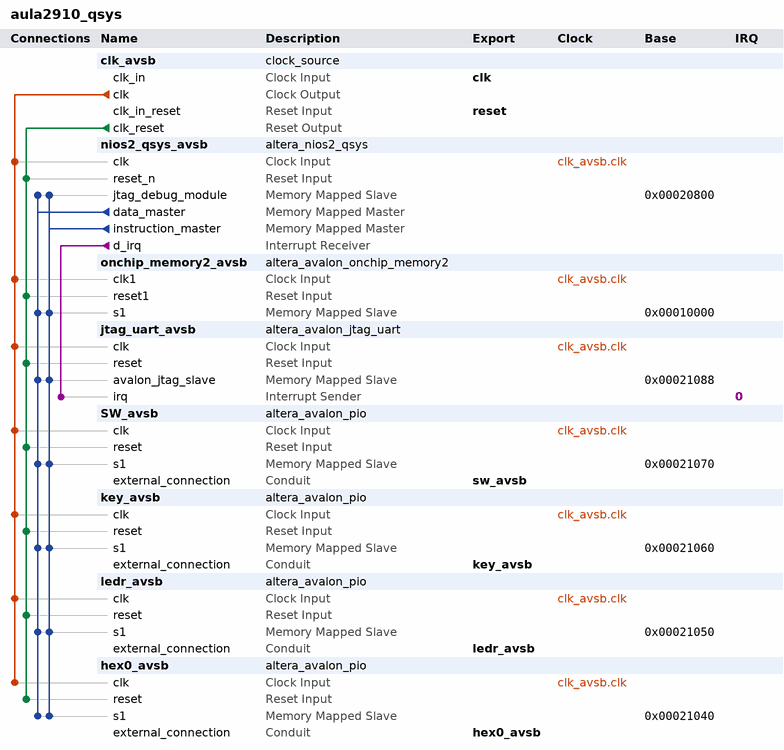
[diagram p0: system contents]
# Platform Designer (Qsys) system aula2910_qsys, Cyclone II EP2C35F672C6
# Parameters at their usual value, and those the tool derives, are not listed.
package require -exact qsys 13.0.1.99.2
create_system aula2910_qsys
set_project_property DEVICE_FAMILY {Cyclone II}
set_project_property DEVICE EP2C35F672C6

add_instance clk_avsb clock_source 13.0
set_instance_parameter_value clk_avsb clockFrequency 50000000

add_instance nios2_qsys_avsb altera_nios2_qsys 13.0
set_instance_parameter_value nios2_qsys_avsb resetSlave onchip_memory2_avsb.s1
set_instance_parameter_value nios2_qsys_avsb mmu_TLBMissExcSlave None
set_instance_parameter_value nios2_qsys_avsb exceptionSlave onchip_memory2_avsb.s1
set_instance_parameter_value nios2_qsys_avsb breakSlave nios2_qsys_avsb.jtag_debug_module
set_instance_parameter_value nios2_qsys_avsb impl Tiny
set_instance_parameter_value nios2_qsys_avsb icache_size 4096

add_instance onchip_memory2_avsb altera_avalon_onchip_memory2 13.0.1.99.2
set_instance_parameter_value onchip_memory2_avsb dataWidth 32
set_instance_parameter_value onchip_memory2_avsb dualPort false
set_instance_parameter_value onchip_memory2_avsb initMemContent true
set_instance_parameter_value onchip_memory2_avsb initializationFileName onchip_mem.hex
set_instance_parameter_value onchip_memory2_avsb memorySize 40960

add_instance jtag_uart_avsb altera_avalon_jtag_uart 13.0.1.99.2
set_instance_parameter_value jtag_uart_avsb simInteractiveOptions NO_INTERACTIVE_WINDOWS

add_instance SW_avsb altera_avalon_pio 13.0.1.99.2
set_instance_parameter_value SW_avsb direction Input
set_instance_parameter_value SW_avsb width 8

add_instance key_avsb altera_avalon_pio 13.0.1.99.2
set_instance_parameter_value key_avsb direction Input
set_instance_parameter_value key_avsb width 4

add_instance ledr_avsb altera_avalon_pio 13.0.1.99.2
set_instance_parameter_value ledr_avsb direction Output
set_instance_parameter_value ledr_avsb width 8

add_instance hex0_avsb altera_avalon_pio 13.0.1.99.2
set_instance_parameter_value hex0_avsb direction Output
set_instance_parameter_value hex0_avsb width 7

# connections
add_connection clk_avsb.clk hex0_avsb.clk clock
add_connection clk_avsb.clk jtag_uart_avsb.clk clock
add_connection clk_avsb.clk key_avsb.clk clock
add_connection clk_avsb.clk ledr_avsb.clk clock
add_connection clk_avsb.clk nios2_qsys_avsb.clk clock
add_connection clk_avsb.clk onchip_memory2_avsb.clk1 clock
add_connection clk_avsb.clk SW_avsb.clk clock
add_connection clk_avsb.clk_reset hex0_avsb.reset reset
add_connection clk_avsb.clk_reset jtag_uart_avsb.reset reset
add_connection clk_avsb.clk_reset key_avsb.reset reset
add_connection clk_avsb.clk_reset ledr_avsb.reset reset
add_connection clk_avsb.clk_reset nios2_qsys_avsb.reset_n reset
add_connection clk_avsb.clk_reset onchip_memory2_avsb.reset1 reset
add_connection clk_avsb.clk_reset SW_avsb.reset reset
add_connection nios2_qsys_avsb.data_master hex0_avsb.s1 avalon
set_connection_parameter_value nios2_qsys_avsb.data_master/hex0_avsb.s1 baseAddress 0x00021040
add_connection nios2_qsys_avsb.data_master jtag_uart_avsb.avalon_jtag_slave avalon
set_connection_parameter_value nios2_qsys_avsb.data_master/jtag_uart_avsb.avalon_jtag_slave baseAddress 0x00021088
add_connection nios2_qsys_avsb.data_master key_avsb.s1 avalon
set_connection_parameter_value nios2_qsys_avsb.data_master/key_avsb.s1 baseAddress 0x00021060
add_connection nios2_qsys_avsb.data_master ledr_avsb.s1 avalon
set_connection_parameter_value nios2_qsys_avsb.data_master/ledr_avsb.s1 baseAddress 0x00021050
add_connection nios2_qsys_avsb.data_master nios2_qsys_avsb.jtag_debug_module avalon
set_connection_parameter_value nios2_qsys_avsb.data_master/nios2_qsys_avsb.jtag_debug_module baseAddress 0x00020800
add_connection nios2_qsys_avsb.data_master onchip_memory2_avsb.s1 avalon
set_connection_parameter_value nios2_qsys_avsb.data_master/onchip_memory2_avsb.s1 baseAddress 0x00010000
add_connection nios2_qsys_avsb.data_master SW_avsb.s1 avalon
set_connection_parameter_value nios2_qsys_avsb.data_master/SW_avsb.s1 baseAddress 0x00021070
add_connection nios2_qsys_avsb.instruction_master hex0_avsb.s1 avalon
set_connection_parameter_value nios2_qsys_avsb.instruction_master/hex0_avsb.s1 baseAddress 0x00021040
add_connection nios2_qsys_avsb.instruction_master jtag_uart_avsb.avalon_jtag_slave avalon
set_connection_parameter_value nios2_qsys_avsb.instruction_master/jtag_uart_avsb.avalon_jtag_slave baseAddress 0x00021088
add_connection nios2_qsys_avsb.instruction_master key_avsb.s1 avalon
set_connection_parameter_value nios2_qsys_avsb.instruction_master/key_avsb.s1 baseAddress 0x00021060
add_connection nios2_qsys_avsb.instruction_master ledr_avsb.s1 avalon
set_connection_parameter_value nios2_qsys_avsb.instruction_master/ledr_avsb.s1 baseAddress 0x00021050
add_connection nios2_qsys_avsb.instruction_master nios2_qsys_avsb.jtag_debug_module avalon
set_connection_parameter_value nios2_qsys_avsb.instruction_master/nios2_qsys_avsb.jtag_debug_module baseAddress 0x00020800
add_connection nios2_qsys_avsb.instruction_master onchip_memory2_avsb.s1 avalon
set_connection_parameter_value nios2_qsys_avsb.instruction_master/onchip_memory2_avsb.s1 baseAddress 0x00010000
add_connection nios2_qsys_avsb.instruction_master SW_avsb.s1 avalon
set_connection_parameter_value nios2_qsys_avsb.instruction_master/SW_avsb.s1 baseAddress 0x00021070
add_connection nios2_qsys_avsb.d_irq jtag_uart_avsb.irq interrupt
set_connection_parameter_value nios2_qsys_avsb.d_irq/jtag_uart_avsb.irq irqNumber 0

# exported interfaces
add_interface clk clock sink
set_interface_property clk EXPORT_OF clk_avsb.clk_in
add_interface reset reset sink
set_interface_property reset EXPORT_OF clk_avsb.clk_in_reset
add_interface sw_avsb conduit end
set_interface_property sw_avsb EXPORT_OF SW_avsb.external_connection
add_interface key_avsb conduit end
set_interface_property key_avsb EXPORT_OF key_avsb.external_connection
add_interface ledr_avsb conduit end
set_interface_property ledr_avsb EXPORT_OF ledr_avsb.external_connection
add_interface hex0_avsb conduit end
set_interface_property hex0_avsb EXPORT_OF hex0_avsb.external_connection

set_interconnect_requirement {$system} qsys_mm.clockCrossingAdapter HANDSHAKE
set_interconnect_requirement {$system} qsys_mm.maxAdditionalLatency 1

save_system aula2910_qsys.qsys
